# Altium schematic sheet mian.SchDoc
size A2
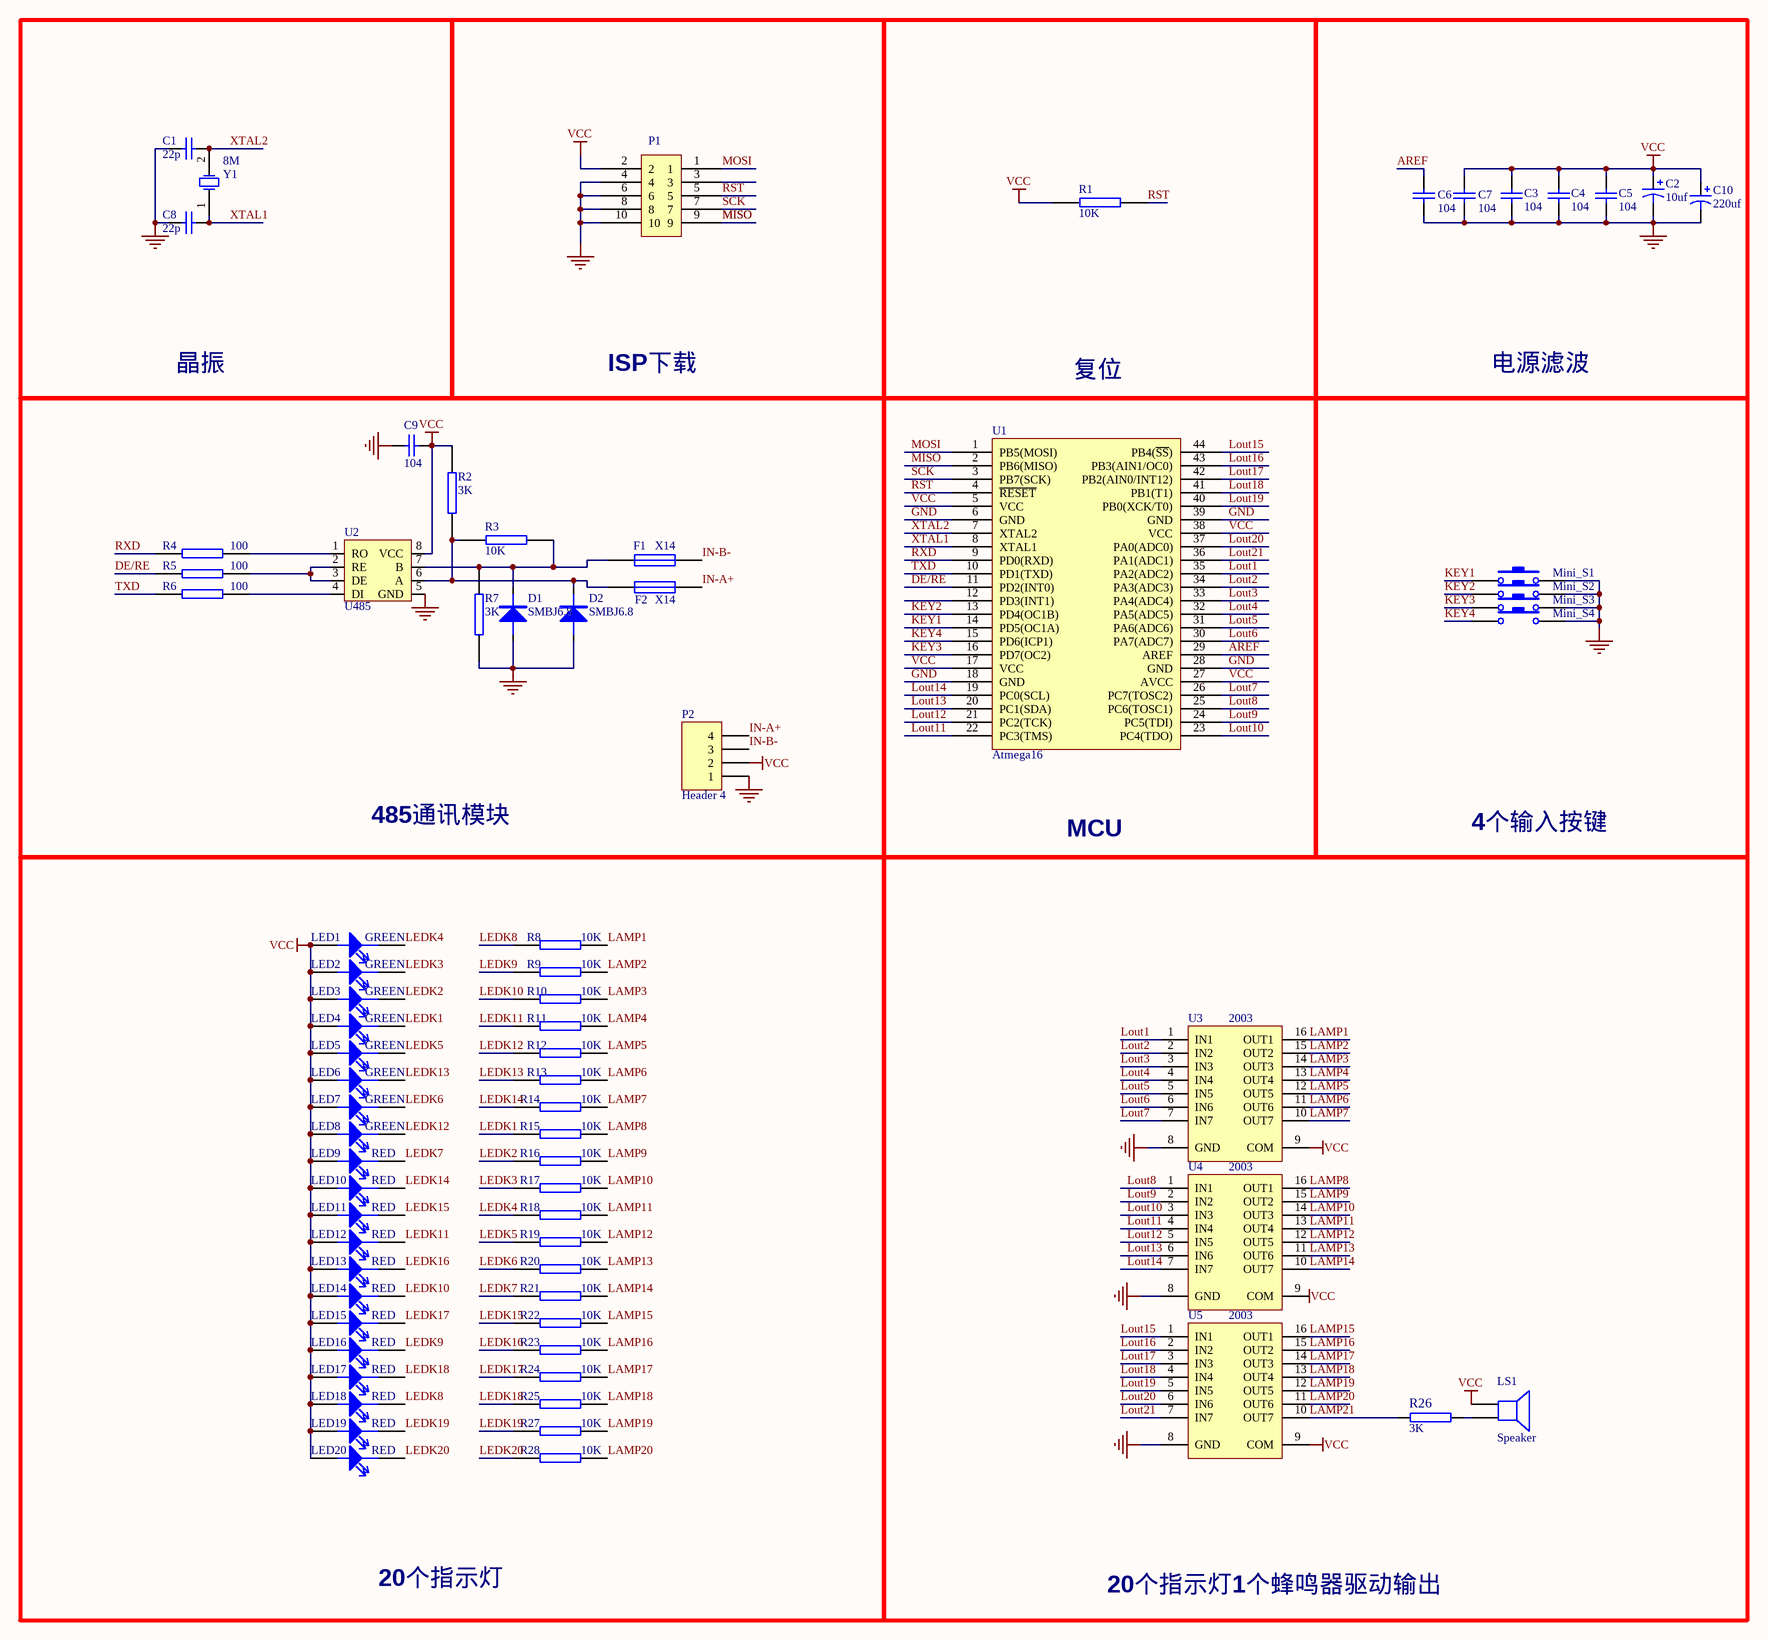
[diagram p0: mian.SchDoc]

## Parts
C1  22p  [c0805c]
C2  10uf  [E6.5MM]
C3  104  [c0805c]
C4  104  [c0805c]
C5  104  [c0805c]
C6  104  [c0805c]
C7  104  [c0805c]
C8  22p  [c0805c]
C9  104  [c0805c]
C10  220uf  [E6.5MM]
D1  SMBJ6.8  [SMBJ_SMT]
D2  SMBJ6.8  [SMBJ_SMT]
F1  X14  [PPTC_SMT]
F2  X14  [PPTC_SMT]
LED1  GREEN  [PLED10*10]
LED2  GREEN  [PLED10*10]
LED3  GREEN  [PLED10*10]
LED4  GREEN  [PLED10*10]
LED5  GREEN  [PLED10*10]
LED6  GREEN  [PLED10*10]
LED7  GREEN  [PLED10*10]
LED8  GREEN  [PLED10*10]
LED9  RED  [PLED10*10]
LED10  RED  [PLED10*10]
LED11  RED  [PLED10*10]
LED12  RED  [PLED10*10]
LED13  RED  [PLED10*10]
LED14  RED  [PLED10*10]
LED15  RED  [PLED10*10]
LED16  RED  [PLED10*10]
LED17  RED  [PLED10*10]
LED18  RED  [PLED10*10]
LED19  RED  [PLED10*10]
LED20  RED  [PLED10*10]
LS1  Speaker  [SPK]
Mini_S1  (no value)  [KEYL]
Mini_S2  (no value)  [KEYL]
Mini_S3  (no value)  [KEYL]
Mini_S4  (no value)  [KEYL]
P1  CON10  [ISP]  (value not drawn)
P2  Header 4  [C3-4L]
R1  10K  [0805C]
R2  3K  [0805C]
R3  10K  [0805C]
R4  100  [0805C]
R5  100  [0805C]
R6  100  [0805C]
R7  3K  [0805C]
R8  10K  [0805C]
R9  10K  [0805C]
R10  10K  [0805C]
R11  10K  [0805C]
R12  10K  [0805C]
R13  10K  [0805C]
R14  10K  [0805C]
R15  10K  [0805C]
R16  10K  [0805C]
R17  10K  [0805C]
R18  10K  [0805C]
R19  10K  [0805C]
R20  10K  [0805C]
R21  10K  [0805C]
R22  10K  [0805C]
R23  10K  [0805C]
R24  10K  [0805C]
R25  10K  [0805C]
R26  3K  [0805C]
R27  10K  [0805C]
R28  10K  [0805C]
U1  Atmega16  [QFP44]
U2  U485  [SOP8]
U3  2003  [SO_16]
U4  2003  [SO_16]
U5  2003  [SO_16]
Y1  8M  [XTP2]

## Blocks framed on the sheet
晶振: C1 C8 Y1
ISP下载: P1
复位: R1
电源滤波: C2-C7 C10
485通讯模块: C9 D1 D2 F1 F2 P2 R2-R7 U2
MCU: U1
4个输入按键: Mini_S1-Mini_S4
20个指示灯: LED1-LED20 R8-R25 R27 R28
20个指示灯1个蜂鸣器驱动输出: LS1 R26 U3-U5

## Nets
GND: C1.2 C2.2 C3.1 C4.1 C5.2 C6.1 C7.1 C8.2 C9.2 C10.2 D1.A D2.A Mini_S1.2 Mini_S2.2 Mini_S3.2 Mini_S4.2 P1.4 P1.6 P1.8 P1.10 P2.1 R7.1 U1.6(GND) U1.18(GND) U1.28(GND) U1.39(GND) U2.5(GND) U3.8(GND) U4.8(GND) U5.8(GND)
VCC: C2.1 C3.2 C4.2 C5.1 C7.2 C9.1 C10.1 LED1.A LED2.A LED3.A LED4.A LED5.A LED6.A LED7.A LED8.A LED9.A LED10.A LED11.A LED12.A LED13.A LED14.A LED15.A LED16.A LED17.A LED18.A LED19.A LED20.A LS1.1 P1.2 P2.2 R1.2 R2.1 U1.5(VCC) U1.17(VCC) U1.27(AVCC) U1.38(VCC) U2.8(VCC) U3.9(COM) U4.9(COM) U5.9(COM)
AREF: C6.2 U1.29(AREF)
DE/RE: R5.2 U1.11(PD2(INT0))
IN-A+: F2.1 P2.4
IN-B-: F1.1 P2.3
KEY1: Mini_S1.1 U1.14(PD5(OC1A))
KEY2: Mini_S2.1 U1.13(PD4(OC1B))
KEY3: Mini_S3.1 U1.16(PD7(OC2))
KEY4: Mini_S4.1 U1.15(PD6(ICP1))
LAMP1: R8.2 U3.16(OUT1)
LAMP2: R9.2 U3.15(OUT2)
LAMP3: R10.2 U3.14(OUT3)
LAMP4: R11.2 U3.13(OUT4)
LAMP5: R12.2 U3.12(OUT5)
LAMP6: R13.2 U3.11(OUT6)
LAMP7: R14.2 U3.10(OUT7)
LAMP8: R15.2 U4.16(OUT1)
LAMP9: R16.2 U4.15(OUT2)
LAMP10: R17.2 U4.14(OUT3)
LAMP11: R18.2 U4.13(OUT4)
LAMP12: R19.2 U4.12(OUT5)
LAMP13: R20.2 U4.11(OUT6)
LAMP14: R21.2 U4.10(OUT7)
LAMP15: R22.2 U5.16(OUT1)
LAMP16: R23.2 U5.15(OUT2)
LAMP17: R24.2 U5.14(OUT3)
LAMP18: R25.2 U5.13(OUT4)
LAMP19: R27.2 U5.12(OUT5)
LAMP20: R28.2 U5.11(OUT6)
LAMP21: R26.1 U5.10(OUT7)
LEDK1: LED4.K R15.1
LEDK2: LED3.K R16.1
LEDK3: LED2.K R17.1
LEDK4: LED1.K R18.1
LEDK5: LED5.K R19.1
LEDK6: LED7.K R20.1
LEDK7: LED9.K R21.1
LEDK8: LED18.K R8.1
LEDK9: LED16.K R9.1
LEDK10: LED14.K R10.1
LEDK11: LED12.K R11.1
LEDK12: LED8.K R12.1
LEDK13: LED6.K R13.1
LEDK14: LED10.K R14.1
LEDK15: LED11.K R22.1
LEDK16: LED13.K R23.1
LEDK17: LED15.K R24.1
LEDK18: LED17.K R25.1
LEDK19: LED19.K R27.1
LEDK20: LED20.K R28.1
Lout1: U1.35(PA2(ADC2)) U3.1(IN1)
Lout2: U1.34(PA3(ADC3)) U3.2(IN2)
Lout3: U1.33(PA4(ADC4)) U3.3(IN3)
Lout4: U1.32(PA5(ADC5)) U3.4(IN4)
Lout5: U1.31(PA6(ADC6)) U3.5(IN5)
Lout6: U1.30(PA7(ADC7)) U3.6(IN6)
Lout7: U1.26(PC7(TOSC2)) U3.7(IN7)
Lout8: U1.25(PC6(TOSC1)) U4.1(IN1)
Lout9: U1.24(PC5(TDI)) U4.2(IN2)
Lout10: U1.23(PC4(TDO)) U4.3(IN3)
Lout11: U1.22(PC3(TMS)) U4.4(IN4)
Lout12: U1.21(PC2(TCK)) U4.5(IN5)
Lout13: U1.20(PC1(SDA)) U4.6(IN6)
Lout14: U1.19(PC0(SCL)) U4.7(IN7)
Lout15: U1.44(PB4(~{SS})) U5.1(IN1)
Lout16: U1.43(PB3(AIN1/OC0)) U5.2(IN2)
Lout17: U1.42(PB2(AIN0/INT12)) U5.3(IN3)
Lout18: U1.41(PB1(T1)) U5.4(IN4)
Lout19: U1.40(PB0(XCK/T0)) U5.5(IN5)
Lout20: U1.37(PA0(ADC0)) U5.6(IN6)
Lout21: U1.36(PA1(ADC1)) U5.7(IN7)
MISO: P1.9 U1.2(PB6(MISO))
MOSI: P1.1 U1.1(PB5(MOSI))
RST: P1.5 R1.1 U1.4(~{RESET})
RXD: R4.2 U1.9(PD0(RXD))
SCK: P1.7 U1.3(PB7(SCK))
TXD: R6.2 U1.10(PD1(TXD))
XTAL1: C8.1 U1.8(XTAL1) Y1.1(OSC1)
XTAL2: C1.1 U1.7(XTAL2) Y1.2(OSC2)
NetD1_K: D1.K F1.2 R3.1 R7.2 U2.7(B)
NetD2_K: D2.K F2.2 R2.2 R3.2 U2.6(A)
NetLS1_2: LS1.2 R26.2
NetR4_1: R4.1 U2.1(RO)
NetR5_1: R5.1 U2.2(RE) U2.3(DE)
NetR6_1: R6.1 U2.4(DI)

Not connected (* = marked no-connect by the designer): P1 3; U1 12(PD3(INT1))

## Library data of the parts
C1 C3-C9 = Cap: Capacitor; Published: 8-Jun-2000; LatestRevisionDate: 17-Jul-2002; LatestRevisionNote: Re-released for DXP Platform.; Publisher: Altium Limited
  C1 C8: Value: 22P
  C3-C7 C9: Value: 104
C2 = Cap Pol1: Polarized Capacitor (Radial); Published: 8-Jun-2000; LatestRevisionDate: 17-Jul-2002; LatestRevisionNote: Re-released for DXP Platform.; Publisher: Altium Limited; Value: 10uf
C10 = Cap Pol1: Polarized Capacitor (Radial); Value: 10uf; Published: 8-Jun-2000; LatestRevisionDate: 17-Jul-2002; LatestRevisionNote: Re-released for DXP Platform.; Publisher: Altium Limited
D1 D2 = DIODE
F1 F2 = Fuse 1: Fuse; Published: 8-Jun-2000; LatestRevisionDate: 17-Jul-2002; LatestRevisionNote: Re-released for DXP Platform.; PackageReference: PIN-W2/E2.8; Publisher: Altium Limited
LED1-LED20 = LED: Zener Diode
LS1 = Speaker: Loudspeaker; Published: 24-Mar-1999; LatestRevisionDate: 17-Jul-2002; LatestRevisionNote: Re-released for DXP Platform.; PackageReference: PIN2; Publisher: Altium Limited
Mini_S1-Mini_S4 = SW-PB: Switch; Published: 24-Mar-1999; LatestRevisionDate: 17-Jul-2002; LatestRevisionNote: Re-released for DXP Platform.; PackageReference: SPST-2; Publisher: Altium Limited; PackageDescription: Switch; 2 Leads
P1 = SPI10
P2 = Header 4: Header, 4-Pin; LatestRevisionDate: 17-Jul-2002; LatestRevisionNote: Re-released for DXP Platform.; Publisher: Altium Limited
R1-R28 = RES2
U3-U5 = ULN2003A: High-Voltage, High-Current Darlington Array; Published: *; LatestRevisionDate: *; LatestRevisionNote: *; DatasheetVersion: *; PackageVersion: *; PackageReference: *; Publisher: *; PackageDescription: *; Code_JEDEC: *; ComponentLink1Description: *; ComponentLink1URL: *
Y1 = XTAL: Crystal Oscillator; Published: 8-Jun-2000; LatestRevisionDate: 17-Jul-2002; LatestRevisionNote: Re-released for DXP Platform.; Publisher: Altium Limited